# Altium schematic sheet A5000_8MB.SchDoc: ARM2 to ARM3 Adapter
size A3; DocumentNumber: 1; SheetNumber: 2; SheetTotal: 5
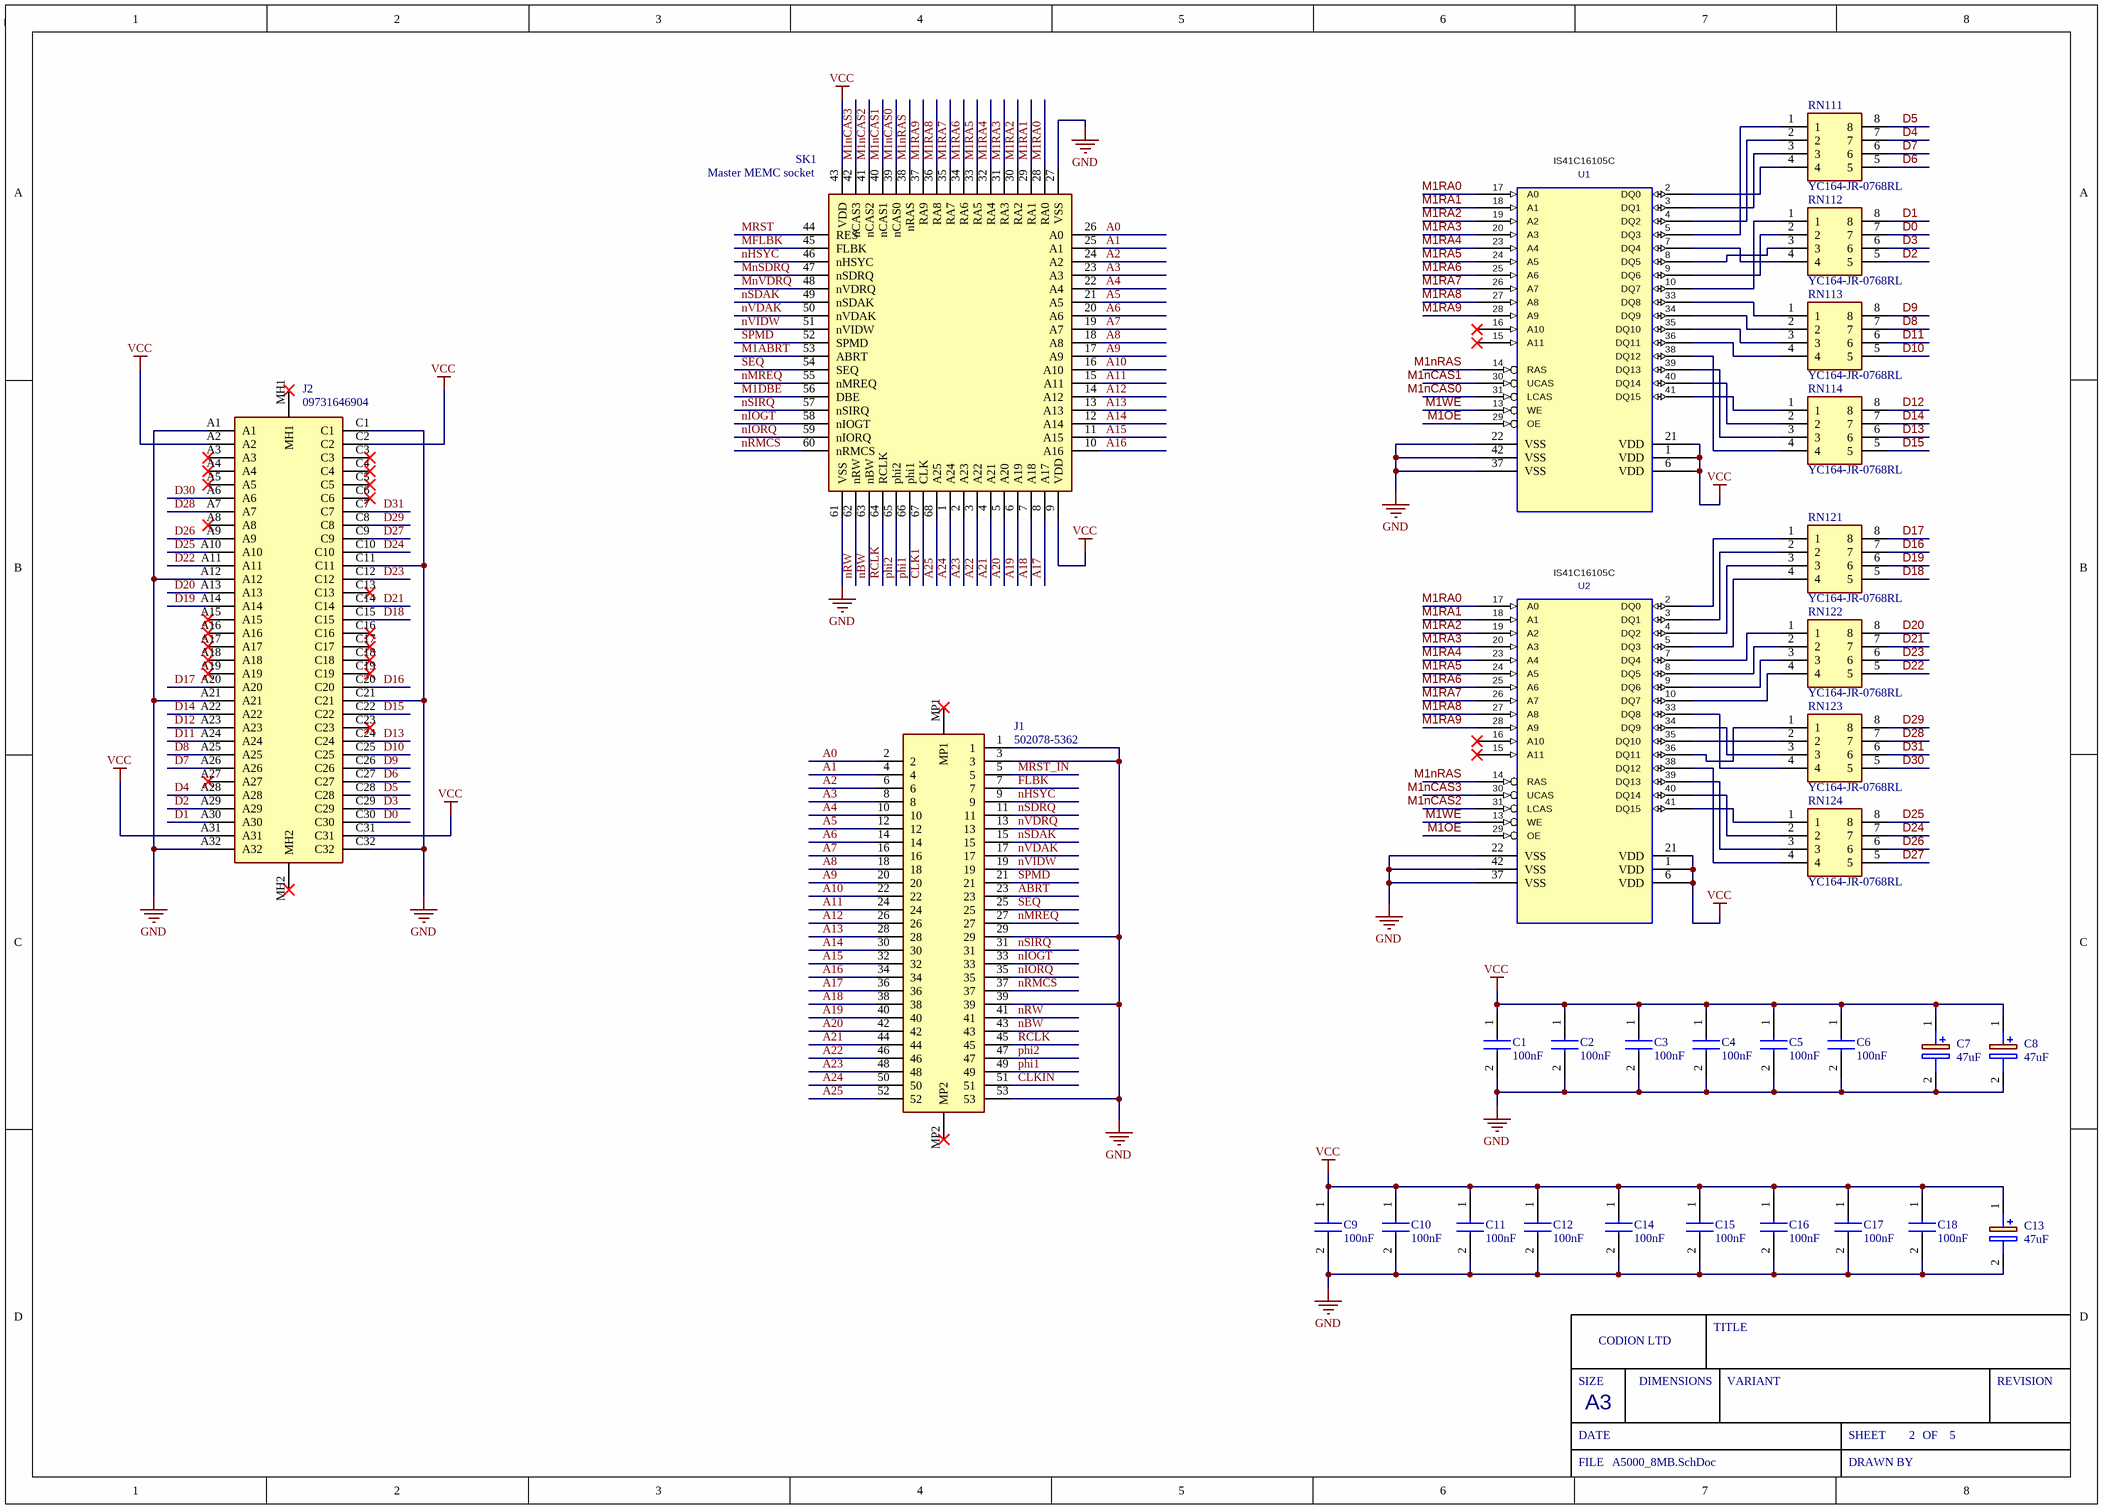
[diagram p0: A5000_8MB.SchDoc]

## Parts
C1  100nF  [0805cap]
C2  100nF  [0805cap]
C3  100nF  [0805cap]
C4  100nF  [0805cap]
C5  100nF  [0805cap]
C6  100nF  [0805cap]
C7  47uF  [EEE1AA101SP]
C8  47uF  [EEE1AA101SP]
C9  100nF  [0805cap]
C10  100nF  [0805cap]
C11  100nF  [0805cap]
C12  100nF  [0805cap]
C13  47uF  [EEE1AA101SP]
C14  100nF  [0805cap]
C15  100nF  [0805cap]
C16  100nF  [0805cap]
C17  100nF  [0805cap]
C18  100nF  [0805cap]
J1  502078-5362  [5020785362]
J2  09731646904  [09731646904]
RN111  YC164-JR-0768RL  [YC164JR0768RL]
RN112  YC164-JR-0768RL  [YC164JR0768RL]
RN113  YC164-JR-0768RL  [YC164JR0768RL]
RN114  YC164-JR-0768RL  [YC164JR0768RL]
RN121  YC164-JR-0768RL  [YC164JR0768RL]
RN122  YC164-JR-0768RL  [YC164JR0768RL]
RN123  YC164-JR-0768RL  [YC164JR0768RL]
RN124  YC164-JR-0768RL  [YC164JR0768RL]
SK1  Master MEMC socket  [MEMC_Socket]
U1  IS41C16105C  [SOJ-42]
U2  IS41C16105C  [SOJ-42]

## Nets
GND: C1.2 C2.2 C3.2 C4.2 C5.2 C6.2 C7.2(-) C8.2(-) C9.2 C10.2 C11.2 C12.2 C13.2(-) C14.2 C15.2 C16.2 C17.2 C18.2 J1.1 J1.3 J1.29 J1.39 J1.53 J2.A1 J2.A12 J2.A21 J2.A32 J2.C1 J2.C11 J2.C21 J2.C32 SK1.27(VSS) SK1.61(VSS) U1.22(VSS) U1.37(VSS) U1.42(VSS) U2.22(VSS) U2.37(VSS) U2.42(VSS)
VCC: C1.1 C2.1 C3.1 C4.1 C5.1 C6.1 C7.1(+) C8.1(+) C9.1 C10.1 C11.1 C12.1 C13.1(+) C14.1 C15.1 C16.1 C17.1 C18.1 J2.A2 J2.A31 J2.C2 J2.C31 SK1.9(VDD) SK1.43(VDD) U1.1(VCC) U1.6(VCC) U1.21(VCC) U2.1(VCC) U2.6(VCC) U2.21(VCC)
A0: J1.2 SK1.26(A0)
A1: J1.4 SK1.25(A1)
A2: J1.6 SK1.24(A2)
A3: J1.8 SK1.23(A3)
A4: J1.10 SK1.22(A4)
A5: J1.12 SK1.21(A5)
A6: J1.14 SK1.20(A6)
A7: J1.16 SK1.19(A7)
A8: J1.18 SK1.18(A8)
A9: J1.20 SK1.17(A9)
A10: J1.22 SK1.16(A10)
A11: J1.24 SK1.15(A11)
A12: J1.26 SK1.14(A12)
A13: J1.28 SK1.13(A13)
A14: J1.30 SK1.12(A14)
A15: J1.32 SK1.11(A15)
A16: J1.34 SK1.10(A16)
A17: J1.36 SK1.8(A17)
A18: J1.38 SK1.7(A18)
A19: J1.40 SK1.6(A19)
A20: J1.42 SK1.5(A20)
A21: J1.44 SK1.4(A21)
A22: J1.46 SK1.3(A22)
A23: J1.48 SK1.2(A23)
A24: J1.50 SK1.1(A24)
A25: J1.52 SK1.68(A25)
ABRT: J1.23
CLK1: SK1.67(CLK)
CLKIN: J1.51
D0: J2.C30 RN112.7
D1: J2.A30 RN112.8
D2: J2.A29 RN112.5
D3: J2.C29 RN112.6
D4: J2.A28 RN111.7
D5: J2.C28 RN111.8
D6: J2.C27 RN111.5
D7: J2.A26 RN111.6
D8: J2.A25 RN113.7
D9: J2.C26 RN113.8
D10: J2.C25 RN113.5
D11: J2.A24 RN113.6
D12: J2.A23 RN114.8
D13: J2.C24 RN114.6
D14: J2.A22 RN114.7
D15: J2.C22 RN114.5
D16: J2.C20 RN121.7
D17: J2.A20 RN121.8
D18: J2.C15 RN121.5
D19: J2.A14 RN121.6
D20: J2.A13 RN122.8
D21: J2.C14 RN122.7
D22: J2.A11 RN122.5
D23: J2.C12 RN122.6
D24: J2.C10 RN124.7
D25: J2.A10 RN124.8
D26: J2.A9 RN124.6
D27: J2.C9 RN124.5
D28: J2.A7 RN123.7
D29: J2.C8 RN123.8
D30: J2.A6 RN123.5
D31: J2.C7 RN123.6
FLBK: J1.7
M1ABRT: SK1.53(ABRT)
M1DBE: SK1.56(DBE)
M1nCAS0: SK1.39(nCAS0) U1.31(LCAS)
M1nCAS1: SK1.40(nCAS1) U1.30(UCAS)
M1nCAS2: SK1.41(nCAS2) U2.31(LCAS)
M1nCAS3: SK1.42(nCAS3) U2.30(UCAS)
M1nRAS: SK1.38(nRAS) U1.14(RAS) U2.14(RAS)
M1OE: U1.29(OE) U2.29(OE)
M1RA0: SK1.28(RA0) U1.17(A0) U2.17(A0)
M1RA1: SK1.29(RA1) U1.18(A1) U2.18(A1)
M1RA2: SK1.30(RA2) U1.19(A2) U2.19(A2)
M1RA3: SK1.31(RA3) U1.20(A3) U2.20(A3)
M1RA4: SK1.32(RA4) U1.23(A4) U2.23(A4)
M1RA5: SK1.33(RA5) U1.24(A5) U2.24(A5)
M1RA6: SK1.34(RA6) U1.25(A6) U2.25(A6)
M1RA7: SK1.35(RA7) U1.26(A7) U2.26(A7)
M1RA8: SK1.36(RA8) U1.27(A8) U2.27(A8)
M1RA9: SK1.37(RA9) U1.28(A9) U2.28(A9)
M1WE: U1.13(WE) U2.13(WE)
MFLBK: SK1.45(FLBK)
MnSDRQ: SK1.47(nSDRQ)
MnVDRQ: SK1.48(nVDRQ)
MRST: SK1.44(RES)
MRST_IN: J1.5
nBW: J1.43 SK1.63(nBW)
nHSYC: J1.9 SK1.46(nHSYC)
nIOGT: J1.33 SK1.58(nIOGT)
nIORQ: J1.35 SK1.59(nIORQ)
nMREQ: J1.27 SK1.55(nMREQ)
nRMCS: J1.37 SK1.60(nRMCS)
nRW: J1.41 SK1.62(nRW)
nSDAK: J1.15 SK1.49(nSDAK)
nSDRQ: J1.11
nSIRQ: J1.31 SK1.57(nSIRQ)
nVDAK: J1.17 SK1.50(nVDAK)
nVDRQ: J1.13
nVIDW: J1.19 SK1.51(nVIDW)
phi1: J1.49 SK1.66(phi1)
phi2: J1.47 SK1.65(phi2)
RCLK: J1.45 SK1.64(RCLK)
SEQ: J1.25 SK1.54(SEQ)
SPMD: J1.21 SK1.52(SPMD)
NetRN111_1: RN111.1 U1.5(DQ3)
NetRN111_2: RN111.2 U1.4(DQ2)
NetRN111_3: RN111.3 U1.3(DQ1)
NetRN111_4: RN111.4 U1.2(DQ0)
NetRN112_1: RN112.1 U1.10(DQ7)
NetRN112_2: RN112.2 U1.9(DQ6)
NetRN112_3: RN112.3 U1.8(DQ5)
NetRN112_4: RN112.4 U1.7(DQ4)
NetRN113_1: RN113.1 U1.33(DQ8)
NetRN113_2: RN113.2 U1.34(DQ9)
NetRN113_3: RN113.3 U1.35(DQ10)
NetRN113_4: RN113.4 U1.36(DQ11)
NetRN114_1: RN114.1 U1.41(DQ15)
NetRN114_2: RN114.2 U1.40(DQ14)
NetRN114_3: RN114.3 U1.39(DQ13)
NetRN114_4: RN114.4 U1.38(DQ12)
NetRN121_1: RN121.1 U2.2(DQ0)
NetRN121_2: RN121.2 U2.3(DQ1)
NetRN121_3: RN121.3 U2.4(DQ2)
NetRN121_4: RN121.4 U2.5(DQ3)
NetRN122_1: RN122.1 U2.7(DQ4)
NetRN122_2: RN122.2 U2.8(DQ5)
NetRN122_3: RN122.3 U2.9(DQ6)
NetRN122_4: RN122.4 U2.10(DQ7)
NetRN123_1: RN123.1 U2.36(DQ11)
NetRN123_2: RN123.2 U2.35(DQ10)
NetRN123_3: RN123.3 U2.34(DQ9)
NetRN123_4: RN123.4 U2.33(DQ8)
NetRN124_1: RN124.1 U2.41(DQ15)
NetRN124_2: RN124.2 U2.40(DQ14)
NetRN124_3: RN124.3 U2.39(DQ13)
NetRN124_4: RN124.4 U2.38(DQ12)

Not connected (* = marked no-connect by the designer): J1 MP1* MP2*; J2 A3* A4* A5* A8* A15* A16* A17* A18* A19* A27* C3* C4* C5* C6* C13* C16* C17* C18* C19* C23* MH1* MH2*; U1 15(A11)* 16(A10)*; U2 15(A11)* 16(A10)*

## Notes on the sheet
- SIZE
- CODION LTD
- DIMENSIONS
- TITLE
- VARIANT
- REVISION
- DATE
- A3
- SHEET
- OF
- FILE
- DRAWN BY

## Library data of the parts
C1-C6 C9-C12 C14-C18 = 100nF0805: Capacitor; Manufacturer_Name: TDK; Manufacturer_Part_Number: C2012X7R1H104K125AM; Datasheet Link: https://product.tdk.com/info/en/catalog/datasheets/mlcc_commercial_midvoltage_en.pdf; Height: 1.45mm; Mouser Part Number: 810-C2012X7R1H104KT5; Mouser Price/Stock: https://www.mouser.com/Search/Refine.aspx?Keyword=810-C2012X7R1H104KT5; Arrow Part Number: C2012X7R1H104K125AM; Arrow Price/Stock: https://www.arrow.com/en/products/c2012x7r1h104k125am/tdk; LCSC Part #: C111492
C7 C8 C13 = EEE1VA470WP: Capacitor Polarised; Manufacturer_Name: Panasonic; Datasheet Link: http://industrial.panasonic.com/cdbs/www-data/pdf/RDE0000/ABA0000C1145.pdf; Height: 7.8mm; Manufacturer_Part_Number: EEE1VA470WP
J1 = 502078-5362: Connector; Manufacturer_Name: Molex; Datasheet Link: https://componentsearchengine.com/Datasheets/1/502078-5362.pdf; Height: 1.15mm; Manufacturer_Part_Number: 502078-5362; Mouser Part Number: 538-502078-5362; Mouser Price/Stock: https://www.mouser.com/Search/Refine.aspx?Keyword=538-502078-5362
J2 = 09731646904: Connector; Manufacturer_Name: HARTING; Datasheet Link: https://b2b.harting.com/files/download/PRD/PDF_DS/PDF_DS_973111.pdf; Height: 11.6mm; Manufacturer_Part_Number: 09731646904; Mouser Part Number: 617-09731646904; Mouser Price/Stock: https://www.mouser.co.uk/ProductDetail/HARTING/09731646904?qs=j4IGAxHIGvykUzMJheztVA%3D%3D; Arrow Part Number: 09731646904; Arrow Price/Stock: https://www.arrow.com/en/products/09731646904/harting
RN111-RN114 RN121-RN124 = YC164-JR-0768RL: Resistor Network; Manufacturer_Name: KEMET; Datasheet Link: https://www.yageo.com/upload/media/product/productsearch/datasheet/rchip/PYu-YC_TC_group_51_RoHS_L_9.pdf; Height: 0.7mm; Manufacturer_Part_Number: YC164-JR-0768RL; Mouser Part Number: 603-YC164-JR-0768RL; Mouser Price/Stock: https://www.mouser.co.uk/ProductDetail/Yageo/YC164-JR-0768RL?qs=8cPjvKtxWv7AOp%2F0jDxI3w%3D%3D; Arrow Part Number: YC164-JR-0768RL; Arrow Price/Stock: https://www.arrow.com/en/products/yc164-jr-0768rl/yageo; LCSC Part #: C695188
SK1 = MEMC_Skt: MEMC socket; Manufacturer_Name: 3M; Manufacturer_Part_Number: 8468-21B1-RK-TR; Datasheet Link: https://www.arrow.com/en/products/8468-21b1-rk-tr/3m; Height: 4.6mm; Mouser Part Number: 517-8468-21B1-RK-TR; Mouser Price/Stock: https://www.mouser.co.uk/ProductDetail/3M-Electronic-Solutions-Division/8468-21B1-RK-TR?qs=X%2F%2F06fXhnJ18zOj3KK47CQ%3D%3D; Arrow Part Number: 8468-21B1-RK-TR; Arrow Price/Stock: https://www.arrow.com/en/products/8468-21b1-rk-tr/3m
U1 U2 = DRAM_1MX16_SOJ: Value: IS41C16105C